# Altium schematic sheet Power.SchDoc
size A4
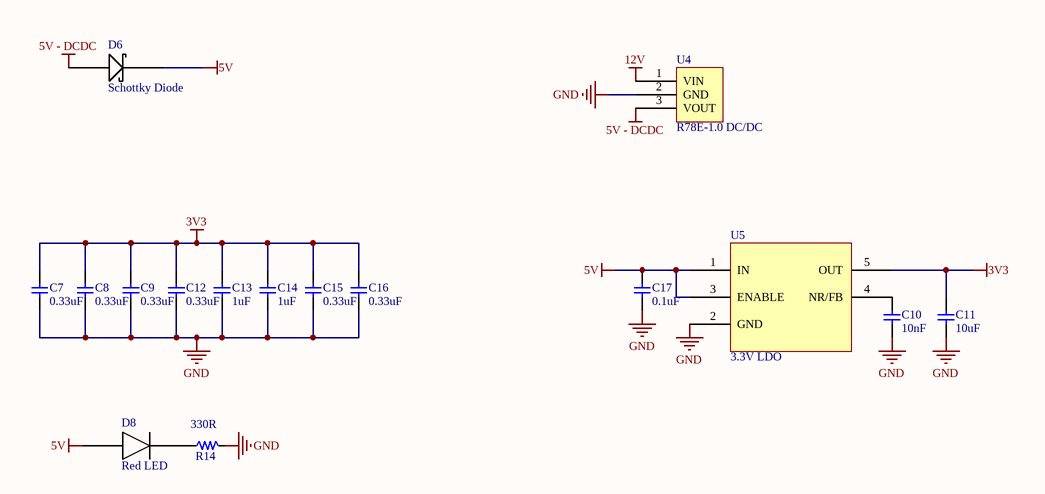
[diagram p0: Power.SchDoc]

## Parts
C7  value 0.33uF  [PCB_GENERIC_SMD_0603]  (hidden comment: C060-0001U-00)
C8  value 0.33uF  [PCB_GENERIC_SMD_0603]  (hidden comment: C060-0001U-00)
C9  value 0.33uF  [PCB_GENERIC_SMD_0603]  (hidden comment: C060-0001U-00)
C10  value 10nF  [PCB_GENERIC_SMD_0603]  (hidden comment: C060-0001U-00)
C11  value 10uF  [PCB_GENERIC_SMD_0603]  (hidden comment: C060-0001U-00)
C12  value 0.33uF  [PCB_GENERIC_SMD_0603]  (hidden comment: C060-0001U-00)
C13  value 1uF  [PCB_GENERIC_SMD_0603]  (hidden comment: C060-0001U-00)
C14  value 1uF  [PCB_GENERIC_SMD_0603]  (hidden comment: C060-0001U-00)
C15  value 0.33uF  [PCB_GENERIC_SMD_0603]  (hidden comment: C060-0001U-00)
C16  value 0.33uF  [PCB_GENERIC_SMD_0603]  (hidden comment: C060-0001U-00)
C17  value 0.1uF  [PCB_GENERIC_SMD_0603]  (hidden comment: C060-0001U-00)
D6  Schottky Diode  [ON Semi Schottky Diode - MBRM110LT1G]
D8  Red LED  [SMD_0603_LED]
R14  Resistance: 330R  [PCB_GENERIC_SMD_0603]  (hidden comment: SCH_GENERIC_RESISTOR_0603)
U4  R78E-1.0 DC/DC  [R78-1.0]
U5  3.3V LDO  [SOT95P280X145-5N]

## Nets
3V3: C7.2 C8.2 C9.2 C11.2 C12.2 C13.1 C14.1 C15.2 C16.2 U5.5(OUT)
5V: C17.2 D6.1 D8.1 U5.1(IN) U5.3(ENABLE)
5V - DCDC: D6.2 U4.3(VOUT)
12V: U4.1(VIN)
GND: C7.1 C8.1 C9.1 C10.1 C11.1 C12.1 C13.2 C14.2 C15.1 C16.1 C17.1 R14.2 U4.2(GND) U5.2(GND)
NetC10_2: C10.2 U5.4(NR/FB)
NetD8_2: D8.2 R14.1

## Library data of the parts
C7-C17 = C060-0001U-00: CAP CER 0603 1uF 16V X5R 20%; Tolerance: 20%; Voltage: 16V; Package: 0603
D6 = ON Semi Schottky Diode - MBRM110LT1G
D8 = SMD_0603_LED
R14 = SCH_GENERIC_RESISTOR_0603: Generic SMD resistor 0603
U4 = R78E-1.0
U5 = 3V3LDO_TPS73633DBVR_SOT23-5: Linear Voltage Regulator IC Positive Fixed 1 Output 3.3V 400mA SOT-23-5